# Altium schematic sheet Общая схема лист 2.SchDoc
size 209 x 297 mm; SheetNumber: 3; SheetTotal: 5
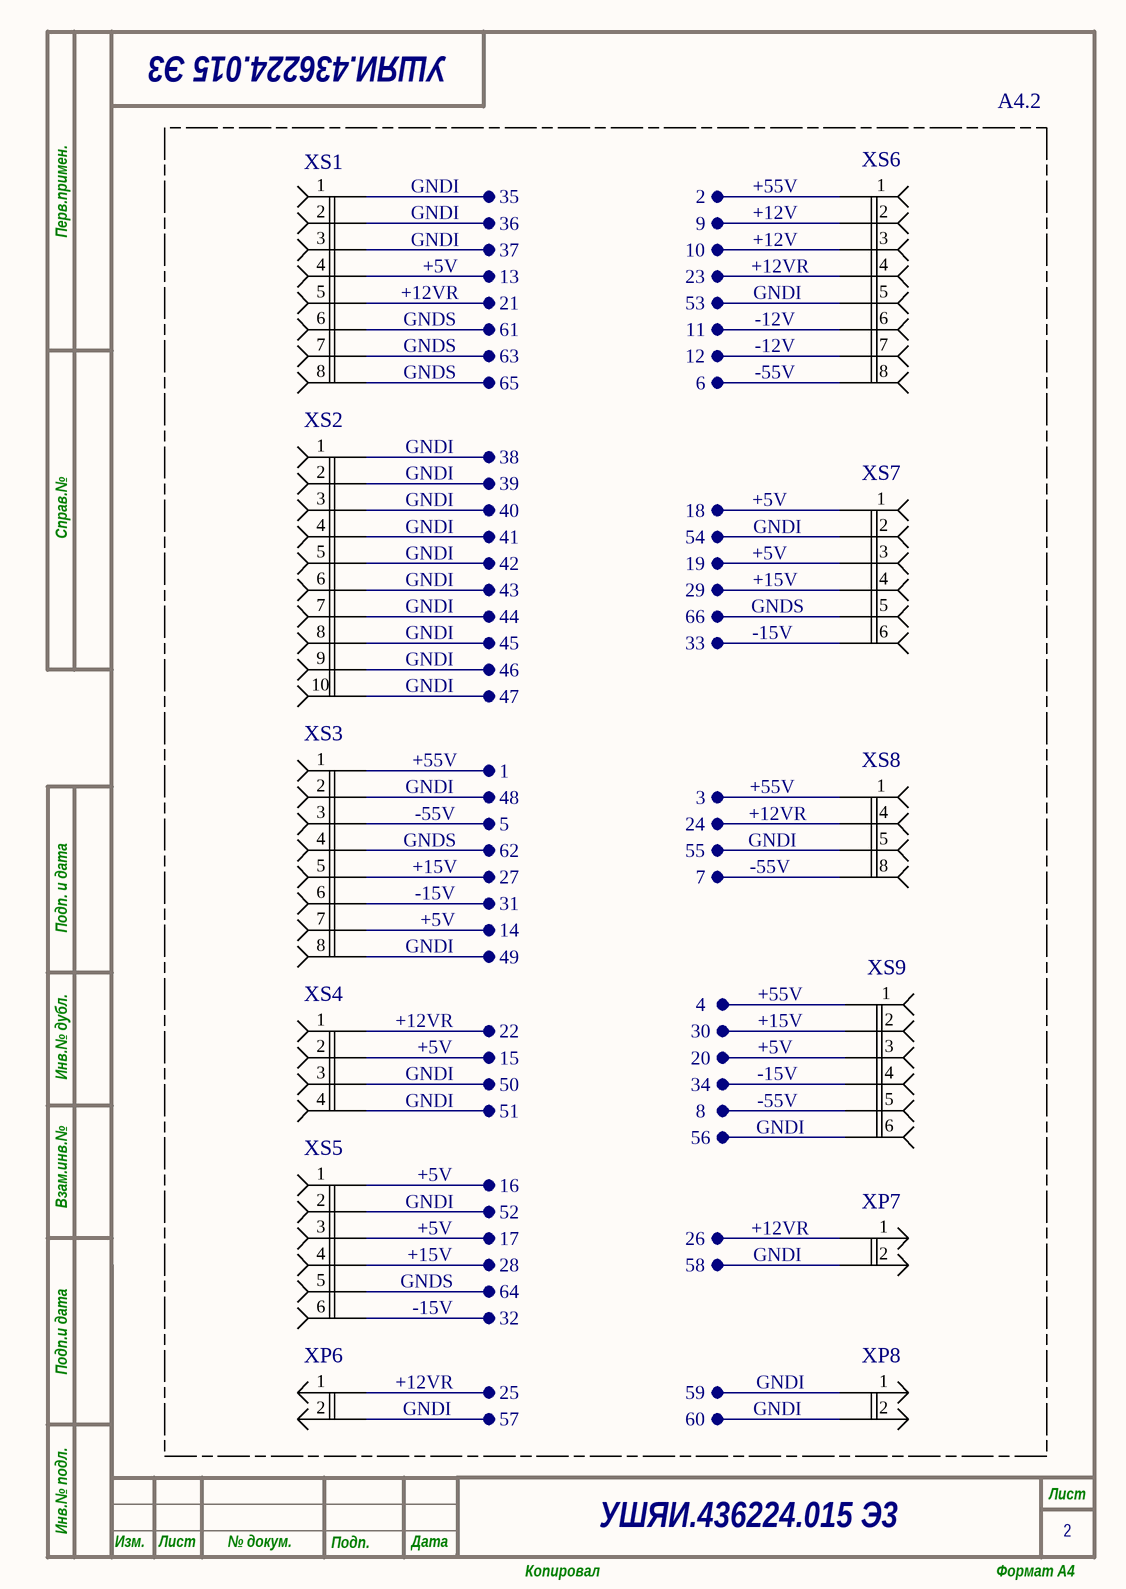
[diagram p0: Общая схема лист 2.SchDoc]

## Parts
XP6  вика 2 пин +  (value not drawn)
XP7  вилка 2 пин -  (value not drawn)
XP8  вилка 2 пин -  (value not drawn)
XS1  розетка 8 пин +  (value not drawn)
XS2  розетка 10 пин +  (value not drawn)
XS3  розетка 8 пин +  (value not drawn)
XS4  розетка 4 пин +  (value not drawn)
XS5  розетка 6 пин +  (value not drawn)
XS6  розетка 8 пин -  (value not drawn)
XS7  розетка 6 пин -  (value not drawn)
XS8  розетка 1458  (value not drawn)
XS9  розетка 6 пин -  (value not drawn)

## Nets

Not connected (* = marked no-connect by the designer): XP6 1 2; XP7 1 2; XP8 1 2; XS1 1 2 3 4 5 6 7 8; XS2 1 2 3 4 5 6 7 8 9 10; XS3 1 2 3 4 5 6 7 8; XS4 1 2 3 4; XS5 1 2 3 4 5 6; XS6 1 2 3 4 5 6 7 8; XS7 1 2 3 4 5 6; XS8 1 4 5 8; XS9 1 2 3 4 5 6

## Notes on the sheet
- УШЯИ.436224.015 Э3
- A4.2
- GNDI
- 35
- 2
- +55V
- +5V
- 36
- 37
- 10
- 9
- +12V
- +12VR
- GNDS
- 61
- 21
- 13
- 23
- 11
- 53
- -12V
- 63
- 65
- 12
- 6
- -55V
- 38
- 41
- 40
- 39
- 18
- 54
- 43
- 42
- 29
- 19
- +15V
- 44
- 45
- 46
- 33
- 66
- -15V
- 47
- 1
- 48
- 3
- 5
- 62
- 55
- 24
- 31
- 27
- 14
- 7
- 49
- 4
- 15
- 22
- 30
- 20
- 51
- 50
- 34
- 56
- 8
- 52
- 16
- 28
- 17
- 58
- 26
- 32
- 64
- 25
- 59
- 57
- 60
- Перв.примен.
- Справ.№
- Подп. и дата
- Инв.№ дубл.
- Взам.инв.№
- Подп.и дата
- Инв.№ подл.
- Изм.
- Лист
- № докум.
- Подп.
- Дата
- Копировал
- Формат А4